# Altium schematic sheet preamp.SchDoc
size A
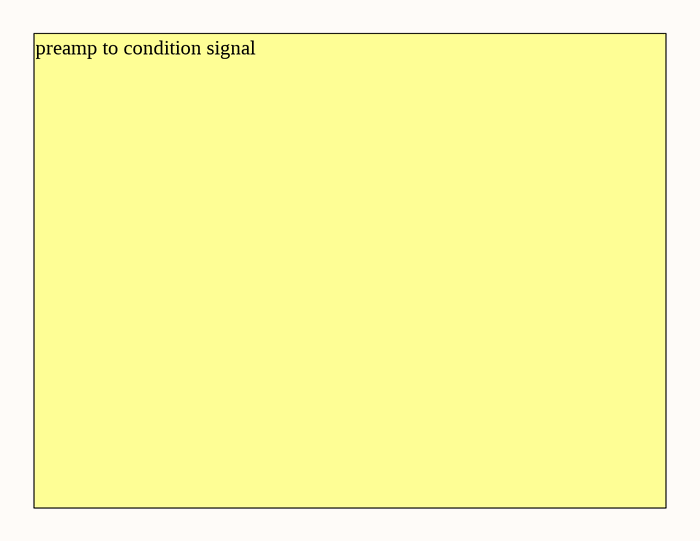
[diagram p0: preamp.SchDoc]

## Notes on the sheet
- preamp to condition signal